# Altium schematic sheet CCU-2-ICs.SchDoc
size A4; SheetNumber: 2; SheetTotal: 3
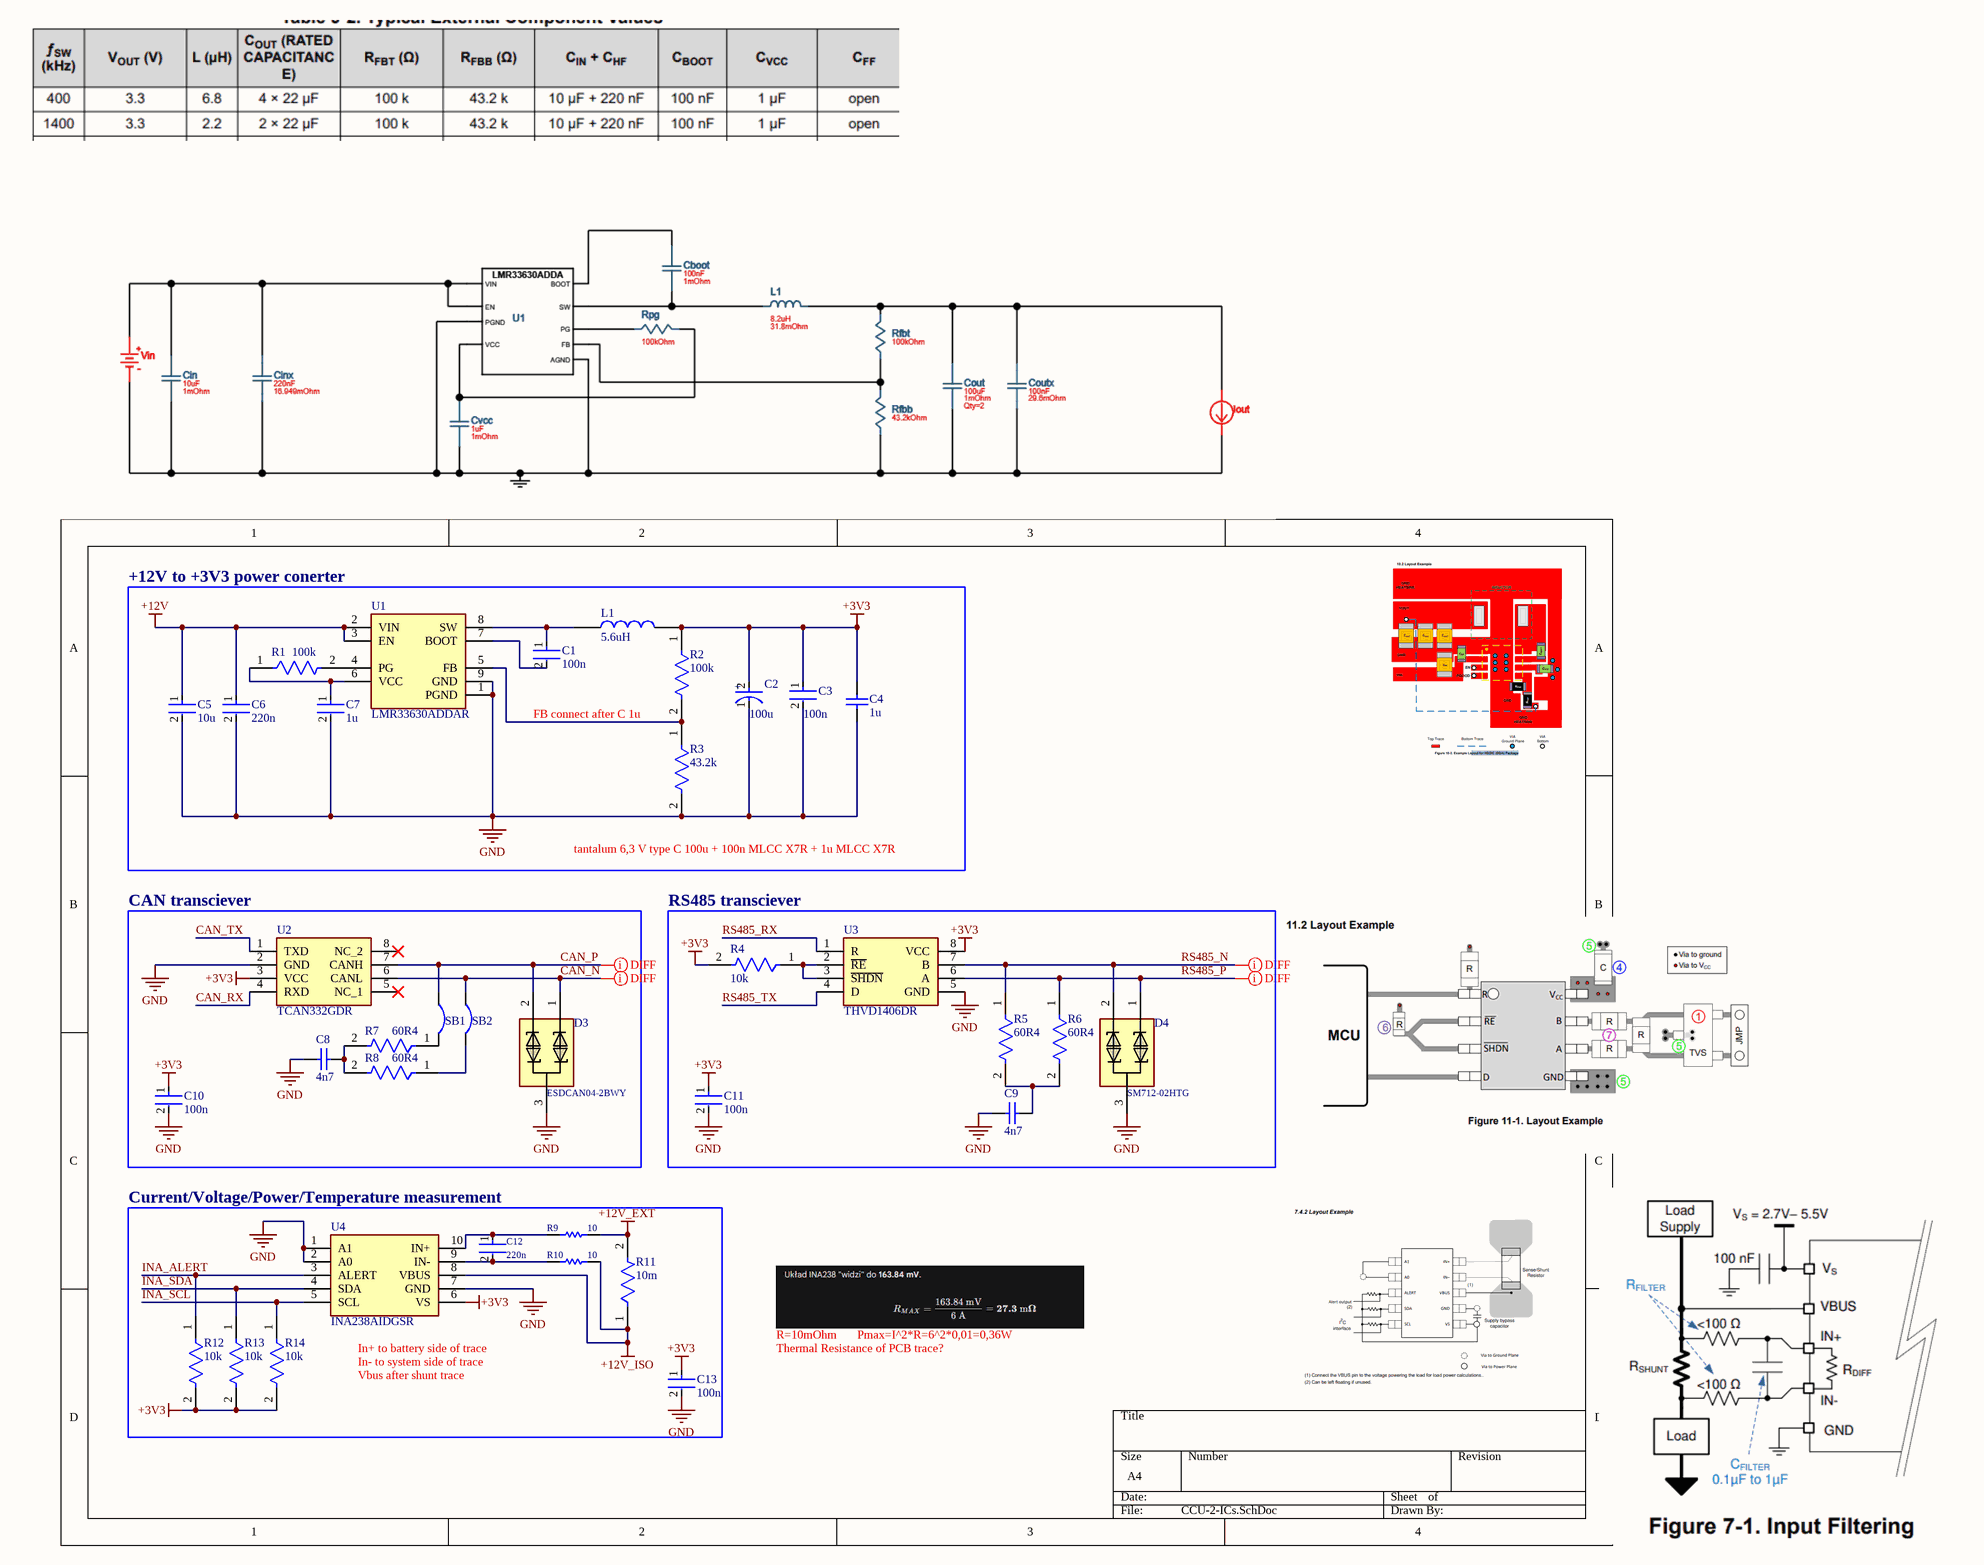
[diagram p0: CCU-2-ICs.SchDoc]

## Parts
C1  100n  [FP-C0603C-CF-MFG]
C2  100u  [FP-TPSC-MFG]
C3  100n  [FP-C0603C-CF-MFG]
C4  1u  [CAPC2013X140X50ML20T25]
C5  10u  [FP-CL32-IPC_C]
C6  220n  [FP-C2012-125-0_2-IPC_C]
C7  1u  [FP-CC0805-0_85-MFG]
C8  4n7  [CAPC2013X145X48NL20T23]
C9  4n7  [CAPC2013X145X48NL20T23]
C10  100n  [FP-C0603C-CF-MFG]
C11  100n  [FP-C0603C-CF-MFG]
C12  220n  [FP-C2012-125-0_2-IPC_C]
C13  100n  [FP-C0603C-CF-MFG]
D3  ESDCAN04-2BWY  [ESDCAN04-2BWY]
D4  SM712-02HTG  [FP-SM712-MFG]
L1  5.6uH  [XAL7070472MEC]
R1  100k  [FP-RC0603-0_55-MFG]
R2  100k  [FP-RC0603-0_55-MFG]
R3  43.2k  [FP-RC0603-0_55-MFG]
R4  10k  [FP-RC0603-0_55-IPC_C]
R5  60R4  [FP-CRCW0603-e3-IPC_C]
R6  60R4  [FP-CRCW0603-e3-IPC_C]
R7  60R4  [FP-CRCW0603-e3-IPC_C]
R8  60R4  [FP-CRCW0603-e3-IPC_C]
R9  10  [RESC1608X55X25NL10T15]
R10  10  [RESC1608X55X25NL10T15]
R11  10m  [FP-CSRF2512-IPC_C]
R12  10k  [FP-RC0603-0_55-IPC_C]
R13  10k  [FP-RC0603-0_55-IPC_C]
R14  10k  [FP-RC0603-0_55-IPC_C]
SB1  Solder_Bridge  [Solder Bridge]  (value not drawn)
SB2  Solder_Bridge  [Solder Bridge]  (value not drawn)
U1  LMR33630ADDAR  [LMR33630ADDAR]
U2  TCAN332GDR  [SOIC127P600X175-8N]
U3  THVD1406DR  [SOIC127P600X175-8N]
U4  INA238AIDGSR  [INA238AIDGSR]

## Blocks framed on the sheet
+12V to +3V3 power conerter: C1-C7 L1 R1-R3 U1
CAN transciever: C8 C10 D3 R7 R8 SB1 SB2 U2
RS485 transciever: C9 C11 D4 R4-R6 U3
Current/Voltage/Power/Temperature measurement: C12 C13 R9-R14 U4

## Nets
+3V3: C2.2(A) C3.1 C4.2 C10.1 C11.1 C13.1 L1.2 R2.1 R4.2 R12.2 R13.2 R14.2 U2.3(VCC) U3.8(VCC) U4.6(VS)
+12V: C5.1 C6.1 U1.2(VIN) U1.3(EN)
+12V_EXT: R9.2 R11.2
+12V_ISO: R10.2 R11.1 U4.8(VBUS)
GND: C2.1(C) C3.2 C4.1 C5.2 C6.2 C7.2 C8.1 C9.1 C10.2 C11.2 C13.2 D3.3 D4.3 R3.2 U1.1(PGND) U1.9(GND) U2.2(GND) U3.5(GND) U4.1(A1) U4.2(A0) U4.7(GND)
CAN_N: D3.1 SB2.1 U2.6(CANL)
CAN_P: D3.2 SB1.1 U2.7(CANH)
CAN_RX: U2.4(RXD)
CAN_TX: U2.1(TXD)
INA_ALERT: R12.1 U4.3(ALERT)
INA_SCL: R14.1 U4.5(SCL)
INA_SDA: R13.1 U4.4(SDA)
RS485_N: D4.2 R5.1 U3.7(B)
RS485_P: D4.1 R6.1 U3.6(A)
RS485_RX: U3.1(R)
RS485_TX: U3.4(D)
NetC1_1: C1.1 L1.1 U1.8(SW)
NetC1_2: C1.2 U1.7(BOOT)
NetC7_1: C7.1 R1.1 U1.6(VCC)
NetC8_2: C8.2 R7.2 R8.2
NetC9_2: C9.2 R5.2 R6.2
NetC12_1: C12.1 R9.1 U4.10(IN+)
NetC12_2: C12.2 R10.1 U4.9(IN-)
NetR1_2: R1.2 U1.4(PG)
NetR2_2: R2.2 R3.1 U1.5(FB)
NetR4_1: R4.1 U3.2(~{RE}) U3.3(~{SHDN})
NetR7_1: R7.1 SB1.2
NetR8_1: R8.1 SB2.2

Not connected (* = marked no-connect by the designer): U2 5(NC_1)* 8(NC_2)*

## Layout directives
differential pair; differential pair class DIFF: CAN_N, CAN_P, RS485_N, RS485_P

## Notes on the sheet
- FB connect after C 1u
- tantalum 6,3 V type C 100u + 100n MLCC X7R + 1u MLCC X7R
- (near U4) In+ to battery side of trace
- In- to system side of trace
- R=10mOhm
- Thermal Resistance of PCB trace?
- Pmax=I^2*R=6^2*0,01=0,36W
- Vbus after shunt trace
- (in symbol CMP-2000-07294-2) +

## Library data of the parts
C1 C3 C10 C11 C13 = CMP-2006-03057-2: CAP CER 0.1UF 25V X7R 0603; Manufacturer Part Number: C0603C104K3RACTU; Manufacturer: KEMET; Value: 0.10 μF; Material: Ceramic; Tolerance: 0.1; Temperature Coefficient: 30ppm/°C; Automotive Grade: Grade 1; Lead Free: Yes; Device Class L3: Ceramic Capacitors; Voltage Rating: 25 V; Digikey Description: CAP CER 0.1UF 25V X7R 0603; Mouser Description: Multilayer Ceramic Capacitors MLCC - SMD/SMT 25volts 0.1uF X7R 10%; Package: C0603C-CF; Temperature Range Low: -55°C; Automotive: Yes; Device Class L2: Capacitors; Octopart: https://octopart.com/c0603c104k3ractu-kemet-127541; ComponentLink2Description: Datasheet; ComponentLink2URL: https://api.kemet.com/component-edge/download/datasheet/C0603C100J5GACAUTO.pdf; Temperature Range High: +125°C; RoHS: TRUE; Device Class L1: Passive Components; Category: Cap; Temperature: -55°C to +125°C; Capacitance: 0.10 μF; Height: 0.87mm; Temperature Characteristic: X7R
C2 = CMP-2000-07294-2: CAP TANT 100UF 10% 10V 2312; Leakage Current: 10uA; Dissipation Factor: 8%; Dielectric Material: Tantalum; ESR (Equivalent Series Resistance): 100mR; Polarity: Polar; Depth: 3.2mm; Number of Pins: 2; Height - Seated (Max): 0.11inch; Case Code (Imperial): 2412; Lead Pitch: 2.9mm; Voltage Rating: 10V; Package Quantity: 1; Size: 2.6mm; Case Code (Metric): 6032; Termination: SMD/SMT; Mount: Surface Mount; Height: 2.6mm; Max Operating Temperature: 125°C; Width: 3.2mm; Radiation Hardening: No; REACH SVHC: No SVHC; Capacitance: 100uF; Packaging: Tape and Reel; Voltage: 10V; Construction: Flat; Case/Package: 6032-28; Features: General Purpose; Lead Free: Lead Free; Length: 6mm; Voltage Rating (DC): 10V; Tolerance: 10%; RoHS Compliant: Yes; Min Operating Temperature: -55°C; Series: TPS
C4 = CMP-2007-04671-1: Manufacturer: AVX Interconnect / Elco; Part Number: 0805ZC105JAT2A
C5 = CMP-2000-06110-2: Cap Ceramic 10uF 50V X7R ±10% SMD 1210 +125°C Embossed T/R; Material: Ceramic; Min Operating Temperature: -55°C; Depth: 2.5mm; Radiation Hardening: No; Capacitance: 10uF; Packaging: Tape and Reel; Dielectric: X7R; Case Code (Metric): 3225; Height: 2.5mm; Thickness: 0.106inch; Voltage Rating (DC): 50V; Voltage Rating: 50V; Width: 0.098inch; Case Code (Imperial): 1210; Length: 3.2mm; Tolerance: 10%; Lead Free: Lead Free; Package Quantity: 1; Voltage: 50V; Mount: Surface Mount; Case/Package: 1210; Max Operating Temperature: 125°C
C6 C12 = CMP-08246-004834-1: Multilayer Ceramic Capacitors 220nF ±10% 50V X7R SMD 0805; Dielectric: X7R; Weight: 0.000194oz; Termination: SMD/SMT; Resistor Type: Ceramic; Case Code (Metric): 2012; Number of Pins: 2; Capacitance: 220nF; REACH SVHC: No SVHC; Dielectric Material: Ceramic; Min Operating Temperature: -55°C; Depth: 1.25mm; Max Operating Temperature: 125°C; Voltage: 50V; Case Code (Imperial): 0805; Thickness: 0.057inch; Mount: Surface Mount; Voltage Rating (DC): 50V; Length: 2mm; Tolerance: 10%; Packaging: Tape and Reel; Package Quantity: 1; Case/Package: 0805; Radiation Hardening: No; Voltage Rating: 50V; Height: 1.25mm; Width: 0.049inch; Series: C; Construction: Flat; RoHS Compliant: Yes; Lead Free: Lead Free
C7 = CMP-2100-03605-2: CAP CER 1UF 25V X7R 0805; Manufacturer Part Number: CC0805KKX7R8BB105; Manufacturer: Yageo; Material: Ceramic; Tolerance: 0.1; Capacitance: 1 uF; Temperature Characteristic: X7R; RoHS: TRUE; Value: 1 uF; Package: CC0805-0.85; Ipc Land Pattern Name: CAPC200125X85; Device Class L2: Capacitors; ComponentLink2URL: http://www.yageo.com/documents/recent/UPY-GPHC_Y5V_6.3V-to-50V_8.pdf; Height: 0.95mm; ComponentLink2Description: Datasheet; Voltage Rating: 25 V; Automotive: No; Device Class L1: Passive Components; Lead Free: Yes; Temperature Range Low: -30°C; Digikey Description: CAP CER 1UF 25V X7R 0805; Temperature: -30°C to +85°C; Temperature Range High: +85°C; Category: Cap; Device Class L3: Ceramic Capacitors; Footprint Url: http://www.yageo.com/exep/pages/download/literatures/UPY-C_GEN_24.pdf; Octopart: https://octopart.com/cc0805kkx7r8bb105-yageo-42244645; Mouser Description: Multilayer Ceramic Capacitor, CC Series, 1 - F, - 10%, X7R, 25 V, 0805 [2012 Metric]
C8 C9 = CMP-2007-01790-1: Manufacturer: Vitramon; Part Number: VJ0805Y222JXAAC
D3 = ESDCAN04-2BWY: TVS DIODE 25.5VWM 43VC SOT323-3 / 43V Clamp 3.7A (8/20µs) Ipp Tvs Diode Surface Mount SOT-323-3; Manufacturer: STMicroelectronics; Breakdown Voltage: 29.1V; Value: 17pF; Max Breakdown Voltage: 30.7V; Min Breakdown Voltage: 27.5V; Number of Channels: 2; Peak Pulse Power: 170W; Peak Reverse Current: 50nA; Polarity: Bidirectional; Reverse Standoff Voltage: 25.5V; Supplier: RS; Supplier Part Number: 1924255; Manufacturer Part Number: ESDCAN04-2BWY; RoHS: Compliant; Category: TVS Diodes; Stock: 5375; China RoHS: Compliant; Clamping Voltage: 43V; Country of Origin: Mainland China; Export Control Classification Number (ECCN) Code: EAR99; Harmonized Tariff Schedule (HTS) Code: 8541.10.00.50; Introduction Date: 2018-11-14; Lifecycle Status: Production; Max Operating Temperature: 175°C; Min Operating Temperature: -55°C; Number of Elements: 2; Number of Terminals: 3; Ratings: AEC-Q101; REACH SVHC: Yes; Schedule B: 8536300000, 8536300000|8536300000|8536300000|8536300000|8536300000; ComponentLink1URL: https://datasheet.octopart.com:443/ESDCAN04-2BWY-STMicroelectronics-datasheet-166055823.pdf?src-supplier=Newark; ComponentLink1Description: https://datasheet.octopart.com:443/ESDCAN04-2BWY-STMicroelectronics-datasheet-166055823.pdf?src-supplier=Newark
D4 = SM712-02HTG: SM712 Series 31 V 600 W Surface Mount Asymmetrical TVS Diode Array - SOT-23-3; Manufacturer: Littelfuse; Breakdown Voltage: 13.3V; Value: 75pF; Clamping Voltage: 31V; Direction: Bidirectional; Element Configuration: Dual; Leakage Current: 1µA; Max Power Dissipation: 600W; Max Surge Current: 19A; Min Breakdown Voltage: 7.5V; Number of Bidirectional Channels: 2; Operating Supply Voltage: 12V; Peak Reverse Current: 20µA; Polarity: Unidirectional; Power Line Protection: No; Reverse Standoff Voltage: 7V; Supplier: Farnell; Supplier Part Number: SM712-02HTG; Manufacturer Part Number: SM712-02HTG; RoHS: Compliant; Category: TVS Diodes; Stock: 30901; Case/Package: SOT-23-3; Composition: Zener; Country of Origin: Mainland China; Depth: 1.4mm; Export Control Classification Number (ECCN) Code: EAR99; Height: 1.12mm; Harmonized Tariff Schedule (HTS) Code: 8541.10.00.50; Introduction Date: 2014-06-09; Lead Free: Lead Free; Length: 3.04mm; Lifecycle Status: Production; Max Operating Temperature: 125°C; Min Operating Temperature: -40°C; Mounting Technology: Surface Mount; Number of Channels: 2; Number of Elements: 2; Pins: 3; Number of Terminals: 3; Peak Pulse Current: 19A; Peak Pulse Power: 600W; Radiation Hardening: No; Ratings: AEC-Q101; REACH SVHC: Yes; Schedule B: 8536300000, 8536300000|8536300000|8536300000|8536300000|8536300000|8536300000|8536300000|8536300000|8536300000|8536300000|8536300000|8536300000|8536300000|8536300000|8536300000|8536300000|8536300000|8536300000|8536300000|8536300000|8536300000|8536300000|8536300000|85; Termination: SMD/SMT; Working Voltage: 12V; ComponentLink1URL: https://datasheet.octopart.com:443/SM712-02HTG-Littelfuse-datasheet-141011933.pdf?src-supplier=element14+APAC; ComponentLink1Description: https://datasheet.octopart.com:443/SM712-02HTG-Littelfuse-datasheet-141011933.pdf?src-supplier=element14+APAC; ComponentLink2URL: https://datasheet.octopart.com:443/SM712-02HTG-Littelfuse-datasheet-32866228.pdf?src-supplier=Upverter; ComponentLink2Description: https://datasheet.octopart.com:443/SM712-02HTG-Littelfuse-datasheet-32866228.pdf?src-supplier=Upverter; ComponentLink3URL: https://datasheet.octopart.com:443/SM712-02HTG-Littelfuse-datasheet-82522105.pdf?src-supplier=TME; ComponentLink3Description: https://datasheet.octopart.com:443/SM712-02HTG-Littelfuse-datasheet-82522105.pdf?src-supplier=TME; ComponentLink4URL: https://datasheet.octopart.com:443/SM712-02HTG-Littelfuse-datasheet-175469618.pdf?src-supplier=JRH+Electronics; ComponentLink4Description: https://datasheet.octopart.com:443/SM712-02HTG-Littelfuse-datasheet-175469618.pdf?src-supplier=JRH+Electronics
L1 = XAL7070-472MEC: General Purpose Inductor, 4.7uH, 20%, 1 Element, Composite-Core, SMD, 3028; Manufacturer_Name: COILCRAFT; Geometry.Height: 7mm; DC Resistance (DCR): 14.26mΩ; Value: 4.7µH; Max Current Rating: 13.6A; Number of Circuits: 1; Saturation Current: 15.2A; Self Resonant Frequency: 26MHz; Shielding: Yes; Test Frequency: 1MHz; Mouser Part Number: 994-XAL7070-472MEC; Mouser Price/Stock: https://www.mouser.co.uk/ProductDetail/Coilcraft/XAL7070-472MEC?qs=zCSbvcPd3pZar3i%2F4%252BSjWg%3D%3D; Manufacturer_Part_Number: XAL7070-472MEC; Datasheet Link: https://www.coilcraft.com/pdfs/xal7070.pdf; Supplier: Farnell; Supplier Part Number: 2289129; Manufacturer: Coilcraft; Manufacturer Part Number: XAL7070-472MEC; RoHS: Compliant; Category: Fixed Inductors; Stock: 742; Ambient Temperature Range High: 125°C; Case/Package: SMD/SMT; Core Material: Composite; Height: 7mm; Inductance Tolerance: 20%; Lead Free: Contains Lead; Length: 8mm; Lifecycle Status: Production; Max DC Current: 13.6A; Max Operating Temperature: 125°C; Min Operating Temperature: -40°C; Mounting Technology: Surface Mount; Number of Terminals: 2; Packaging: Cut Tape; REACH SVHC: Yes; RMS Current (Irms): 13.6A; ESR: 14.26mΩ; Termination: SMD/SMT; Tolerance: 20%; Width: 7.2mm; ComponentLink1URL: https://datasheet.octopart.com:443/XAL7070-472MEC-Coilcraft-datasheet-180122068.pdf?src-supplier=IHS; ComponentLink1Description: https://datasheet.octopart.com:443/XAL7070-472MEC-Coilcraft-datasheet-180122068.pdf?src-supplier=IHS; ComponentLink2URL: https://datasheet.octopart.com:443/XAL7070-472MEC-Coilcraft-datasheet-10791984.pdf?src-supplier=Coilcraft+Direct; ComponentLink2Description: https://datasheet.octopart.com:443/XAL7070-472MEC-Coilcraft-datasheet-10791984.pdf?src-supplier=Coilcraft+Direct; ComponentLink3URL: https://datasheet.octopart.com:443/XAL7070-472MEC-Coilcraft-datasheet-181955335.pdf?src-supplier=Newark; ComponentLink3Description: https://datasheet.octopart.com:443/XAL7070-472MEC-Coilcraft-datasheet-181955335.pdf?src-supplier=Newark; ComponentLink4URL: https://datasheet.octopart.com:443/XAL7070-472MEC-Coilcraft-datasheet-14354386.pdf?src-supplier=Newark; ComponentLink4Description: https://datasheet.octopart.com:443/XAL7070-472MEC-Coilcraft-datasheet-14354386.pdf?src-supplier=Newark
R1 R2 = CMP-2100-03662-2: RES SMD 100K OHM 1% 1/10W 0603; Voltage Rating (DC): 50V; Resistance: 100kR; Max Power Dissipation: 100mW; Temperature Coefficient: 100ppm/°C; Working Voltage: 75V; Length: 1.6mm; Lead Free: Lead Free; Number of Terminations: 2; Packaging: Tape and Reel; Voltage Rating: 50V; Termination: SMD/SMT; Width: 0.8mm; Resistor Type: Thick Film; Resistance Tolerance: 1%; Features: Moisture Resistant; Height: 0.45mm; Construction: Rectangular; Case/Package: 0603; Military Standard: Not; Case Code (Imperial): 0603; Series: RC; Technology: THICK FILM; Depth: 0.8mm; RoHS Compliant: Yes; REACH SVHC: No SVHC; Min Operating Temperature: -55°C; Case Code (Metric): 1608; Max Operating Temperature: 155°C; Power Rating: 100mW; Number of Pins: 2; Tolerance: 1%
R3 = CMP-03412-037801-1: RES SMD 43.2K OHM 1% 1/10W 0603; Power Rating: 100mW; Voltage Rating (DC): 50V; Temperature Coefficient: 100ppm/°C; Resistance: 43.2kR; Depth: 0.8mm; Resistor Type: Thick Film; Mount: Surface Mount; Height: 0.45mm; Termination: SMD/SMT; Case Code (Imperial): 0603; Case Code (Metric): 1608; Case/Package: 0603; Length: 1.6mm; Min Operating Temperature: -55°C; Max Power Dissipation: 100mW; Construction: Rectangular; Lead Free: Lead Free; Features: Moisture Resistant; Technology: THICK FILM; RoHS Compliant: Yes; Packaging: Tape and Reel; Package Quantity: 1; Width: 0.031inch; Tolerance: 1%; Number of Terminations: 2; Series: RC; Voltage Rating: 50V; Max Operating Temperature: 155°C; Size Code: 0603; Military Standard: Not
R4 R12-R14 = CMP-2100-03664-2: RES 10K OHM 1% 1/10W 0603; Voltage Rating: 75V; Voltage Rating (DC): 50V; Resistance: 10kR; Power Rating: 100mW; Temperature Coefficient: 100ppm/°C; Depth: 0.8mm; Termination: SMD/SMT; Resistor Type: Thick Film; Series: RC; Construction: Rectangular; Features: Moisture Resistant; Packaging: Tape and Reel; Min Operating Temperature: -55°C; Number of Terminations: 2; Lead Pitch: 0.3mm; RoHS Compliant: Yes; Case/Package: 0603; Resistance Tolerance: 1%; Military Standard: Not; Weight: 7.1E-05oz; Number of Pins: 2; Tolerance: 1%; Length: 1.6mm; Case Code (Imperial): 0603; Lead Free: Lead Free; Width: 0.8mm; Max Power Dissipation: 100mW; Height: 0.45mm; Max Operating Temperature: 155°C; Case Code (Metric): 1608; Size Code: 0603
R5-R8 = CMP-02407-003155-1: RES Thick Film, 60.4Ω, 1%, 0.1W, 100ppm/°C, 0603; Resistance: 60.4R; Max Power Dissipation: 100mW; Features: Automotive AEC-Q200; Package Quantity: 20000; Lead Free: Lead Free; Height: 0.02inch; Case/Package: 0603; Tolerance: 1%; Packaging: Tape and Reel; Length: 0.061inch; Number of Terminations: 2; Composition: Thick Film; Min Operating Temperature: -55°C; Width: 0.033inch; Temperature Coefficient: 100ppm/°C; Max Operating Temperature: 155°C
R9 R10 = CMP-1659-00008-4: Chip Resistor, 10 Ohm, +/- 1%, 0.1 W, -55 to 155 degC, 0603 (1608 Metric), RoHS, Tape and Reel; Manufacturer: Yageo; Voltage Rating: 50 V; PackageReference: 0603; ComponentLink3Description: Package Specification; Packaging: Tape and Reel; Max Operating Temperature: 155 degC; ComponentLink3URL: http://www.farnell.com/datasheets/443971.pdf; PackageDescription: 2-Pin Surface Mount Device, Body 1.6 x 0.8 mm; ComponentLink1URL: http://www.yageo.com/; Pins: 2; REACH SVHC: No SVHC; RoHSCompliant: true; ComponentLink2URL: http://www.yageo.com/documents/recent/PYu-RC_Group_51_RoHS_L_04.pdf; DatasheetVersion: Rev. 4, 02/2016; Mount: Surface Mount; Package Quantity: 200; Min Operating Temperature: -55 degC; Height: 0.45 mm; Mounting Technology: Surface Mount; ComponentLink1Description: Manufacturer URL; ComponentLink2Description: Datasheet; Length: 1.6 mm
R11 = CMP-26527-006624-1: Foil on Ceramic Current Sensing Chip Resistor 43mΩ ±1% 2W 2512 AEC Qualified; Mount: Surface Mount; Max Operating Temperature: 170°C; Tolerance: 1%; Min Operating Temperature: -55°C; RoHS Compliant: Yes
SB1 SB2 = Solder_Bridge: Bridge 0.5mm gap, 2mm width
U1 = LMR33630ADDAR: SIMPLE SWITCHER® 3.8V to 36V, 3A Synchronous Buck Converter With Ultra-Low EMI 8-SO PowerPAD -40 to 125; Manufacturer_Name: Texas Instruments; Manufacturer Lifecycle Status: ACTIVE; Geometry.Height: 1.7mm; Max Duty Cycle: 98%; Max Junction Temperature (Tj): 150°C; Nominal Supply Current: 24µA; Number of Channels: 1; Switching Frequency: 400kHz; Manufacturer_Part_Number: LMR33630ADDAR; Mouser Part Number: 595-LMR33630ADDAR; Mouser Price/Stock: https://www.mouser.co.uk/ProductDetail/Texas-Instruments/LMR33630ADDAR?qs=r5DSvlrkXmJQkBTqgVdiDA%3D%3D; Arrow Part Number: LMR33630ADDAR; Arrow Price/Stock: https://www.arrow.com/en/products/lmr33630addar/texas-instruments?utm_currency=USD&region=nac; Datasheet Link: http://www.ti.com/lit/gpn/lmr33630; Supplier: DigiKey; Supplier Part Number: 296-49763-1-ND; Manufacturer: Texas Instruments; Manufacturer Part Number: LMR33630ADDAR; RoHS: Compliant; Category: Voltage Regulators - Switching; Stock: 3306; Pricing: 1=2,55, 10=1,895, 25=1,732, 100=1,5527, 250=1,4672, 500=1,41566, 1000=1,37324 (USD); Height: 1.7mm; Length: 4.89mm; Lifecycle Status: Production; Max Operating Temperature: 125°C; Max Supply Voltage: 36V; Min Operating Temperature: -40°C; Min Supply Voltage: 3.8V; Number of Outputs: 1; Pins: 8; Output Current: 3A; Schedule B: 8542390000; Thickness: 1.48mm; Topology: Buck; Width: 3.9mm; ComponentLink1URL: https://octopart.com:443/opatz8j6/c1?t=vB-rOmDI1ErJ0w3fCj8NLsfgClszgTUVbAqCYHM5mRqgzR9RBB5Pla--LZzs2g-5lBj7oDBEHLOY0DNQ8kiPC6C8g1CaFcIk5xusZs0FtDRH-CQ1FAZX0wQ7Af0vopd1OvNJ_Hrieycu-9D8HxSeoZovH4OJEcn7j74SeItdt-lCJsWpQWgV8-mVR1JIQ1KywJKCZ68bDiAWG91PubKPct48upMq1AnCkLHjDL3bhpicF0q3kjtxBAWzeDQzkpoQooz9GAvObiI6PlzZfk112pcCDh0P81IWp_Rr5acb26OlKDk2j5b40au3vy2C1-LFGDaZycRESUfyv9lqHnr9FsK7A0AJECnAAloOYp_c-_g9Mk5jVvAjSOs1Y_7rtCi9vouLs8vl&src-supplier=Texas+Instruments; ComponentLink1Description: https://octopart.com:443/opatz8j6/c1?t=vB-rOmDI1ErJ0w3fCj8NLsfgClszgTUVbAqCYHM5mRqgzR9RBB5Pla--LZzs2g-5lBj7oDBEHLOY0DNQ8kiPC6C8g1CaFcIk5xusZs0FtDRH-CQ1FAZX0wQ7Af0vopd1OvNJ_Hrieycu-9D8HxSeoZovH4OJEcn7j74SeItdt-lCJsWpQWgV8-mVR1JIQ1KywJKCZ68bDiAWG91PubKPct48upMq1AnCkLHjDL3bhpicF0q3kjtxBAWzeDQzkpoQooz9GAvObiI6PlzZfk112pcCDh0P81IWp_Rr5acb26OlKDk2j5b40au3vy2C1-LFGDaZycRESUfyv9lqHnr9FsK7A0AJECnAAloOYp_c-_g9Mk5jVvAjSOs1Y_7rtCi9vouLs8vl&src-supplier=Texas+Instruments; ComponentLink2URL: https://sigma.octopart.com:443/104526336/technical_drawing/Texas-Instruments-LMR33630ADDAR.pdf?src-supplier=Texas+Instruments; ComponentLink2Description: https://sigma.octopart.com:443/104526336/technical_drawing/Texas-Instruments-LMR33630ADDAR.pdf?src-supplier=Texas+Instruments; ComponentLink3URL: https://sigma.octopart.com:443/49250132/technical_drawing/Texas-Instruments-LMR33630ADDAR.pdf?src-supplier=Texas+Instruments; ComponentLink3Description: https://sigma.octopart.com:443/49250132/technical_drawing/Texas-Instruments-LMR33630ADDAR.pdf?src-supplier=Texas+Instruments; ComponentLink4URL: https://datasheet.octopart.com:443/LMR33630ADDAR-Texas-Instruments-datasheet-148393519.pdf?src-supplier=Upverter; ComponentLink4Description: https://datasheet.octopart.com:443/LMR33630ADDAR-Texas-Instruments-datasheet-148393519.pdf?src-supplier=Upverter; ComponentLink5URL: https://datasheet.octopart.com:443/LMR33630ADDAR-Texas-Instruments-datasheet-163730535.pdf?src-supplier=LCSC; ComponentLink5Description: https://datasheet.octopart.com:443/LMR33630ADDAR-Texas-Instruments-datasheet-163730535.pdf?src-supplier=LCSC; ComponentLink6URL: http://sigma.octopart.com:80/reach_statement/Texas-Instruments-company-64.pdf?src-supplier=Compliance+Statements; ComponentLink6Description: http://sigma.octopart.com:80/reach_statement/Texas-Instruments-company-64.pdf?src-supplier=Compliance+Statements; ComponentLink7URL: http://sigma.octopart.com:80/conflict_mineral_statement/Texas-Instruments-company-63.pdf?src-supplier=Compliance+Statements; ComponentLink7Description: http://sigma.octopart.com:80/conflict_mineral_statement/Texas-Instruments-company-63.pdf?src-supplier=Compliance+Statements
U2 = TCAN332GDR: 3.3-V CAN Transceivers with CAN FD (Flexible Data Rate) 8-SOIC -40 to 125; Manufacturer: Texas Instruments; Manufacturer Lifecycle Status: ACTIVE; Supplier: DigiKey; Supplier Part Number: 296-48678-1-ND; Manufacturer Part Number: TCAN332GDR; RoHS: Compliant; Category: CAN Transceivers; Stock: 4774; Pricing: 1=2,71, 10=2,021, 25=1,848, 100=1,6576, 250=1,56684, 500=1,53152 (USD); Case/Package: SOIC; Height: 1.75mm; Lead Free: Lead Free; Length: 4.9mm; Lifecycle Status: Production; Max Operating Temperature: 125°C; Min Operating Temperature: -40°C; Pins: 8; Thickness: 1.58mm; Width: 3.91mm; ComponentLink1URL: https://datasheet.octopart.com:443/TCAN332GDR-Texas-Instruments-datasheet-62057962.pdf?src-supplier=Texas+Instruments; ComponentLink1Description: https://datasheet.octopart.com:443/TCAN332GDR-Texas-Instruments-datasheet-62057962.pdf?src-supplier=Texas+Instruments; ComponentLink2URL: https://octopart.com:443/opatz8j6/c1?t=Fim9K0uhurL3e-64ewRPRu2hzD6XBMTpaS3peMNeRQGdAPJMxV5dpDLVgJyuO_P4O4ggunH2lrh5amG8cDN644qOKp-rMrPHwRhWUIrHn0bzeZVVUbsr2M72b6PgQlxLldm4RQX58xtipHIVUQ9n3j21H1DkLh4_7SXPzTuHaIsBH9AF2gycgFMmCo2d18ECHdzunFD4nFXD1uZ0NZyu2cFq_vDtF5TCh3oQofcxl6XlKc8IRlGphMiWX1-H-GrJRfCOqdlBEaN3yoeUESa4Rdelhx3RTUBrPKmhDb-oLKbaFhGIFdCz5qUOKi7WlXgmp3d98vxT9kb4idGeRYMwJbKCxTgnxtzothCZpspf30IxwGF7roI0pcaKLIGA-2bwGuZ5fiI&src-supplier=Texas+Instruments; ComponentLink2Description: https://octopart.com:443/opatz8j6/c1?t=Fim9K0uhurL3e-64ewRPRu2hzD6XBMTpaS3peMNeRQGdAPJMxV5dpDLVgJyuO_P4O4ggunH2lrh5amG8cDN644qOKp-rMrPHwRhWUIrHn0bzeZVVUbsr2M72b6PgQlxLldm4RQX58xtipHIVUQ9n3j21H1DkLh4_7SXPzTuHaIsBH9AF2gycgFMmCo2d18ECHdzunFD4nFXD1uZ0NZyu2cFq_vDtF5TCh3oQofcxl6XlKc8IRlGphMiWX1-H-GrJRfCOqdlBEaN3yoeUESa4Rdelhx3RTUBrPKmhDb-oLKbaFhGIFdCz5qUOKi7WlXgmp3d98vxT9kb4idGeRYMwJbKCxTgnxtzothCZpspf30IxwGF7roI0pcaKLIGA-2bwGuZ5fiI&src-supplier=Texas+Instruments; ComponentLink3URL: https://datasheet.octopart.com:443/TCAN332GDR-Texas-Instruments-datasheet-61500394.pdf?src-supplier=Texas+Instruments; ComponentLink3Description: https://datasheet.octopart.com:443/TCAN332GDR-Texas-Instruments-datasheet-61500394.pdf?src-supplier=Texas+Instruments; ComponentLink4URL: https://sigma.octopart.com:443/49249642/technical_drawing/Texas-Instruments-TCAN332GDR.pdf?src-supplier=Texas+Instruments; ComponentLink4Description: https://sigma.octopart.com:443/49249642/technical_drawing/Texas-Instruments-TCAN332GDR.pdf?src-supplier=Texas+Instruments; ComponentLink5URL: https://datasheet.octopart.com:443/TCAN332GDR-Texas-Instruments-datasheet-192327331.pdf?src-supplier=HQonline; ComponentLink5Description: https://datasheet.octopart.com:443/TCAN332GDR-Texas-Instruments-datasheet-192327331.pdf?src-supplier=HQonline; ComponentLink6URL: https://datasheet.octopart.com:443/TCAN332GDR-Texas-Instruments-datasheet-159117518.pdf?src-supplier=LCSC; ComponentLink6Description: https://datasheet.octopart.com:443/TCAN332GDR-Texas-Instruments-datasheet-159117518.pdf?src-supplier=LCSC; ComponentLink7URL: https://datasheet.octopart.com:443/TCAN332GDR-Texas-Instruments-datasheet-149637585.pdf?src-supplier=SHENGYU+ELECTRONICS; ComponentLink7Description: https://datasheet.octopart.com:443/TCAN332GDR-Texas-Instruments-datasheet-149637585.pdf?src-supplier=SHENGYU+ELECTRONICS; ComponentLink8URL: http://sigma.octopart.com:80/reach_statement/Texas-Instruments-company-64.pdf?src-supplier=Compliance+Statements; ComponentLink8Description: http://sigma.octopart.com:80/reach_statement/Texas-Instruments-company-64.pdf?src-supplier=Compliance+Statements; ComponentLink9URL: http://sigma.octopart.com:80/conflict_mineral_statement/Texas-Instruments-company-63.pdf?src-supplier=Compliance+Statements; ComponentLink9Description: http://sigma.octopart.com:80/conflict_mineral_statement/Texas-Instruments-company-63.pdf?src-supplier=Compliance+Statements
U3 = THVD1406DR: 3.3-V to 5-V 500-Kbps half-duplex RS-485 transceiver auto-direction control ±12-kV IEC ESD 8-SOIC -40 to 125; Manufacturer: Texas Instruments; Manufacturer Lifecycle Status: ACTIVE; Supplier: DigiKey; Supplier Part Number: 296-THVD1406DRCT-ND; Manufacturer Part Number: THVD1406DR; RoHS: Compliant; Category: Integrated Circuits (ICs); Stock: 2789; Pricing: 1=1,72, 10=1,257, 25=1,1424, 100=1,0164, 250=0,95628, 500=0,92002, 1000=0,91494 (USD); Case/Package: SOIC; Height: 1.75mm; Length: 4.9mm; Lifecycle Status: Production; Pins: 8; Thickness: 1.58mm; Width: 3.91mm; ComponentLink1URL: https://octopart.com:443/opatz8j6/c1?t=2lI__BkUQ1xwY9kHNd8eYxCAM8iLM_FgltEQ1IO6ko7_J5dzlRfErhoS2VuXg-axmu35tHe6xFiPe7MYKPFvV-dy3nIG9s3NJA0ErWfdrKDirdlmgh356IG-PQ2XWgFJDCJccpoQtQsg13hA_5m5lKyDGmkMVNChYEag8uk4WHNZpCeqeZyq-o13vnhtIUj1o03Pf3jmRR3w8kDw90f-34G7o4yUBoqAoakg1O24sFCcCpS3f5lc8pghjzV8L4mAcKX6y6PNE8Xs84P_YNErqjUnXhKNxf-NFzK6TWa9jK5NPoG9ddsY0OtA5ykFXF75BaeKJ_s9JvLxqkj3BXgq8qynINgxI_OyH86OW_yPFQ_-wlcyMHijrRmTrvovB-5KRqPFqPLR&src-supplier=Texas+Instruments; ComponentLink1Description: https://octopart.com:443/opatz8j6/c1?t=2lI__BkUQ1xwY9kHNd8eYxCAM8iLM_FgltEQ1IO6ko7_J5dzlRfErhoS2VuXg-axmu35tHe6xFiPe7MYKPFvV-dy3nIG9s3NJA0ErWfdrKDirdlmgh356IG-PQ2XWgFJDCJccpoQtQsg13hA_5m5lKyDGmkMVNChYEag8uk4WHNZpCeqeZyq-o13vnhtIUj1o03Pf3jmRR3w8kDw90f-34G7o4yUBoqAoakg1O24sFCcCpS3f5lc8pghjzV8L4mAcKX6y6PNE8Xs84P_YNErqjUnXhKNxf-NFzK6TWa9jK5NPoG9ddsY0OtA5ykFXF75BaeKJ_s9JvLxqkj3BXgq8qynINgxI_OyH86OW_yPFQ_-wlcyMHijrRmTrvovB-5KRqPFqPLR&src-supplier=Texas+Instruments; ComponentLink2URL: https://datasheet.octopart.com:443/THVD1406DR-Texas-Instruments-datasheet-183820944.pdf?src-supplier=LCSC; ComponentLink2Description: https://datasheet.octopart.com:443/THVD1406DR-Texas-Instruments-datasheet-183820944.pdf?src-supplier=LCSC; ComponentLink3URL: https://datasheet.octopart.com:443/THVD1406DR-Texas-Instruments-datasheet-165811890.pdf?src-supplier=Augswan; ComponentLink3Description: https://datasheet.octopart.com:443/THVD1406DR-Texas-Instruments-datasheet-165811890.pdf?src-supplier=Augswan; ComponentLink4URL: http://sigma.octopart.com:80/reach_statement/Texas-Instruments-company-64.pdf?src-supplier=Compliance+Statements; ComponentLink4Description: http://sigma.octopart.com:80/reach_statement/Texas-Instruments-company-64.pdf?src-supplier=Compliance+Statements; ComponentLink5URL: http://sigma.octopart.com:80/conflict_mineral_statement/Texas-Instruments-company-63.pdf?src-supplier=Compliance+Statements; ComponentLink5Description: http://sigma.octopart.com:80/conflict_mineral_statement/Texas-Instruments-company-63.pdf?src-supplier=Compliance+Statements
U4 = INA238AIDGSR: 85-V, 16-bit, high-precision I2C output current/voltage/power monitor with alert 10-VSSOP -40 to 125; Manufacturer_Name: Texas Instruments; Manufacturer Lifecycle Status: ACTIVE; Datasheet Link: https://www.ti.com/lit/ds/symlink/ina238.pdf?ts=1623483707955&ref_url=https%253A%252F%252Fwww.ti.com%252Fstore%252Fti%252Fen%252Fp%252Fproduct%252F%253Fp%253DINA238AIDGSR; Height: 1.1mm; Manufacturer_Part_Number: INA238AIDGSR; Mouser Part Number: 595-INA238AIDGSR; Mouser Price/Stock: https://www.mouser.co.uk/ProductDetail/Texas-Instruments/INA238AIDGSR?qs=DRkmTr78QAQpWvQMAkqDfQ%3D%3D; Arrow Part Number: INA238AIDGSR; Arrow Price/Stock: https://www.arrow.com/en/products/ina238aidgsr/texas-instruments?utm_currency=USD&region=nac; Supplier: DigiKey; Supplier Part Number: 296-INA238AIDGSRCT-ND; Manufacturer: Texas Instruments; Manufacturer Part Number: INA238AIDGSR; RoHS: Compliant; Category: Power Management ICs; Pricing: 1=3,26, 10=2,447, 25=2,2428, 100=2,0184, 250=1,91132, 500=1,88344 (USD); Case/Package: VSSOP; Length: 3mm; Lifecycle Status: Production; Pins: 10; Schedule B: 8542390000, 8542390000|8542390000|8542390000|8542390000|8542390000|8542390000|8542390000|8542390000|8542390000|8542390000|8542390000|8542390000|8542390000|8542390000|8542390000|8542390000|8542390000|8542390000|8542390000|8542390000|8542390000|8542390000|8542390000|85; Thickness: 1.02mm; Width: 3mm; ComponentLink1URL: https://octopart.com:443/opatz8j6/c1?t=XyVZTLNm9_ePY3ZGc7WnwxCxujItchuRLJj6CkysUxGARineyf7S9W1lTZtpdvGrKN9PqufXH2Vp5DF4iI0PAmLVRxJtPCoqMa_3Yx7EmCUprcLp9cc2z3mxrocYZYu_H6tNB4RLIZX8yc2_jZwFvl9kWmpghyBnfmfPNCcCHj9WG1KUH3fGvWh-B3Dty5OndKwLiTMuCynuZqQEMvhHYq8OKaCYxicPR-4azPIH5DLbeaRheWP409TW7_NNkIoSlBggBZt8vUz1AkFskQTI-fVfUp_rKcfapwS7xCCwZOKssU3R1jKvkQDpIuWALrIH0VMSswAvOfD7rtoRLVW_XHJHwA1DZFqMh2nUzRUR_hOiShUwC6jqqC2oc9QjG34mHHd3ibY&src-supplier=Texas+Instruments; ComponentLink1Description: https://octopart.com:443/opatz8j6/c1?t=XyVZTLNm9_ePY3ZGc7WnwxCxujItchuRLJj6CkysUxGARineyf7S9W1lTZtpdvGrKN9PqufXH2Vp5DF4iI0PAmLVRxJtPCoqMa_3Yx7EmCUprcLp9cc2z3mxrocYZYu_H6tNB4RLIZX8yc2_jZwFvl9kWmpghyBnfmfPNCcCHj9WG1KUH3fGvWh-B3Dty5OndKwLiTMuCynuZqQEMvhHYq8OKaCYxicPR-4azPIH5DLbeaRheWP409TW7_NNkIoSlBggBZt8vUz1AkFskQTI-fVfUp_rKcfapwS7xCCwZOKssU3R1jKvkQDpIuWALrIH0VMSswAvOfD7rtoRLVW_XHJHwA1DZFqMh2nUzRUR_hOiShUwC6jqqC2oc9QjG34mHHd3ibY&src-supplier=Texas+Instruments; ComponentLink2URL: https://datasheet.octopart.com:443/INA238AIDGSR-Texas-Instruments-datasheet-165811307.pdf?src-supplier=Augswan; ComponentLink2Description: https://datasheet.octopart.com:443/INA238AIDGSR-Texas-Instruments-datasheet-165811307.pdf?src-supplier=Augswan; ComponentLink3URL: https://datasheet.octopart.com:443/INA238AIDGSR-Texas-Instruments-datasheet-169738673.pdf?src-supplier=LCSC; ComponentLink3Description: https://datasheet.octopart.com:443/INA238AIDGSR-Texas-Instruments-datasheet-169738673.pdf?src-supplier=LCSC; ComponentLink4URL: http://sigma.octopart.com:80/reach_statement/Texas-Instruments-company-64.pdf?src-supplier=Compliance+Statements; ComponentLink4Description: http://sigma.octopart.com:80/reach_statement/Texas-Instruments-company-64.pdf?src-supplier=Compliance+Statements; ComponentLink5URL: http://sigma.octopart.com:80/conflict_mineral_statement/Texas-Instruments-company-63.pdf?src-supplier=Compliance+Statements; ComponentLink5Description: http://sigma.octopart.com:80/conflict_mineral_statement/Texas-Instruments-company-63.pdf?src-supplier=Compliance+Statements; Supplier 1: DigiKey; Supplier Part Number 1: 296-INA238AIDGSRCT-ND